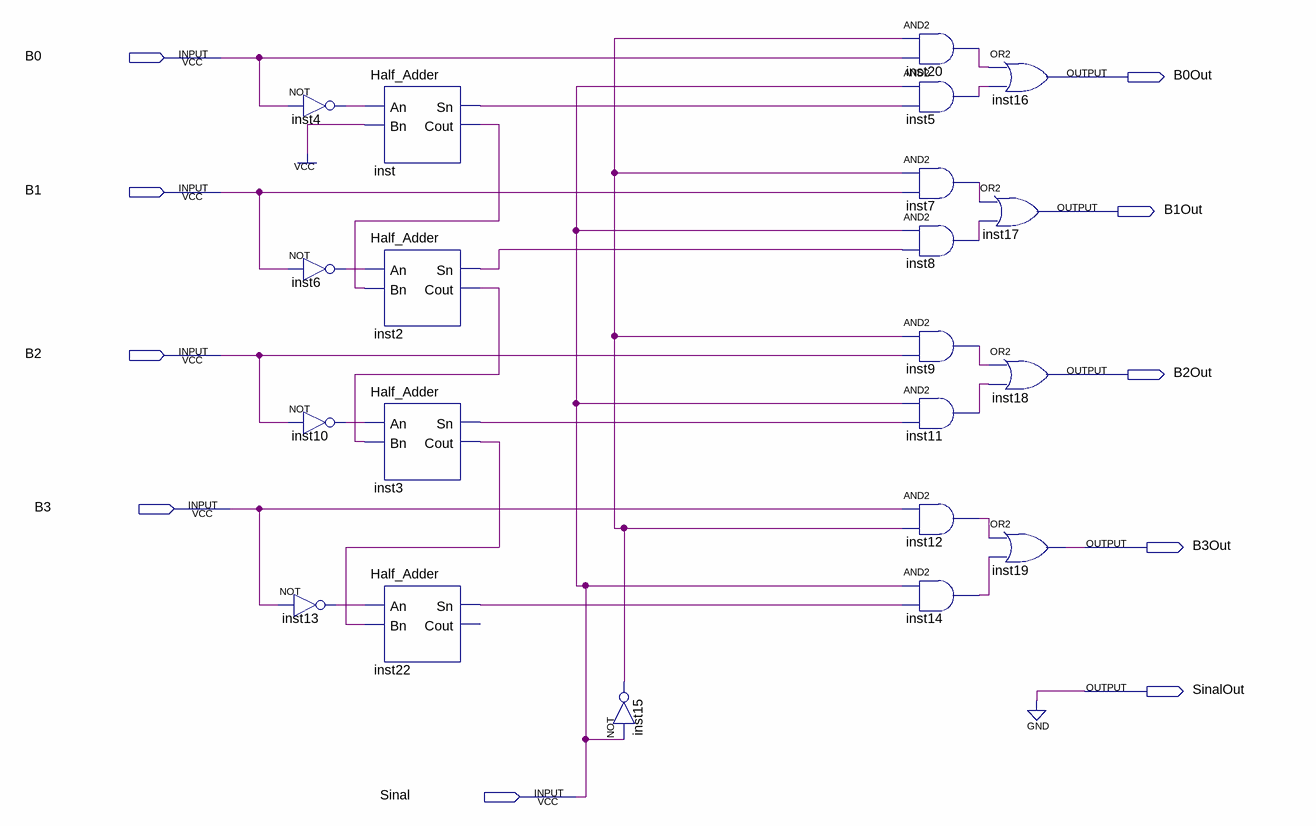
[diagram p0: schematic sheet]
// Quartus schematic Complemento_5Bits.bdf as structural Verilog: 21 symbols, 10 pins
module Complemento_5Bits (
  input  B0,
  input  B1,
  input  B2,
  input  B3,
  input  Sinal,
  output B0Out,
  output B1Out,
  output B2Out,
  output B3Out,
  output SinalOut
);

  wire inst2_cout, inst2_sn, inst3_cout, inst3_sn, inst4_out, inst5_out, inst6_out, inst7_out, inst8_out,
       inst9_out, inst10_out, inst11_out, inst12_out, inst13_out, inst14_out, inst15_out, inst20_out,
       inst22_sn, inst_cout, inst_sn;

  not inst4 (inst4_out, B0);
  not inst6 (inst6_out, B1);
  not inst10 (inst10_out, B2);
  not inst13 (inst13_out, B3);
  Half_Adder inst (.An(inst4_out), .Bn(1'b1), .Sn(inst_sn), .Cout(inst_cout));
  Half_Adder inst2 (.An(inst6_out), .Bn(inst_cout), .Sn(inst2_sn), .Cout(inst2_cout));
  Half_Adder inst3 (.An(inst10_out), .Bn(inst2_cout), .Sn(inst3_sn), .Cout(inst3_cout));
  Half_Adder inst22 (.An(inst13_out), .Bn(inst3_cout), .Sn(inst22_sn));  // open: Cout
  not inst15 (inst15_out, Sinal);
  and inst20 (inst20_out, inst15_out, B0);
  and inst5 (inst5_out, Sinal, inst_sn);
  and inst7 (inst7_out, inst15_out, B1);
  and inst8 (inst8_out, Sinal, inst2_sn);
  and inst9 (inst9_out, inst15_out, B2);
  and inst11 (inst11_out, Sinal, inst3_sn);
  and inst12 (inst12_out, B3, inst15_out);
  and inst14 (inst14_out, Sinal, inst22_sn);
  or inst16 (B0Out, inst20_out, inst5_out);
  or inst17 (B1Out, inst7_out, inst8_out);
  or inst18 (B2Out, inst9_out, inst11_out);
  or inst19 (B3Out, inst12_out, inst14_out);

  assign SinalOut = 1'b0;
endmodule
